# Altium schematic sheet 1.54inch_e-Paper.SchDoc
size A4; Author: Franciszek Zarębski; CompanyName: Politechnika Warszawska; Organization: EITI; Address1: Nowowiejska 15/19; Address2: 00-665 Warszawa; Revision: 1; SheetNumber: 3; SheetTotal: 4; HTTPLink: www.pw.edu.pl; Group_Name: Smartwatch; ProjName: Smartwatch
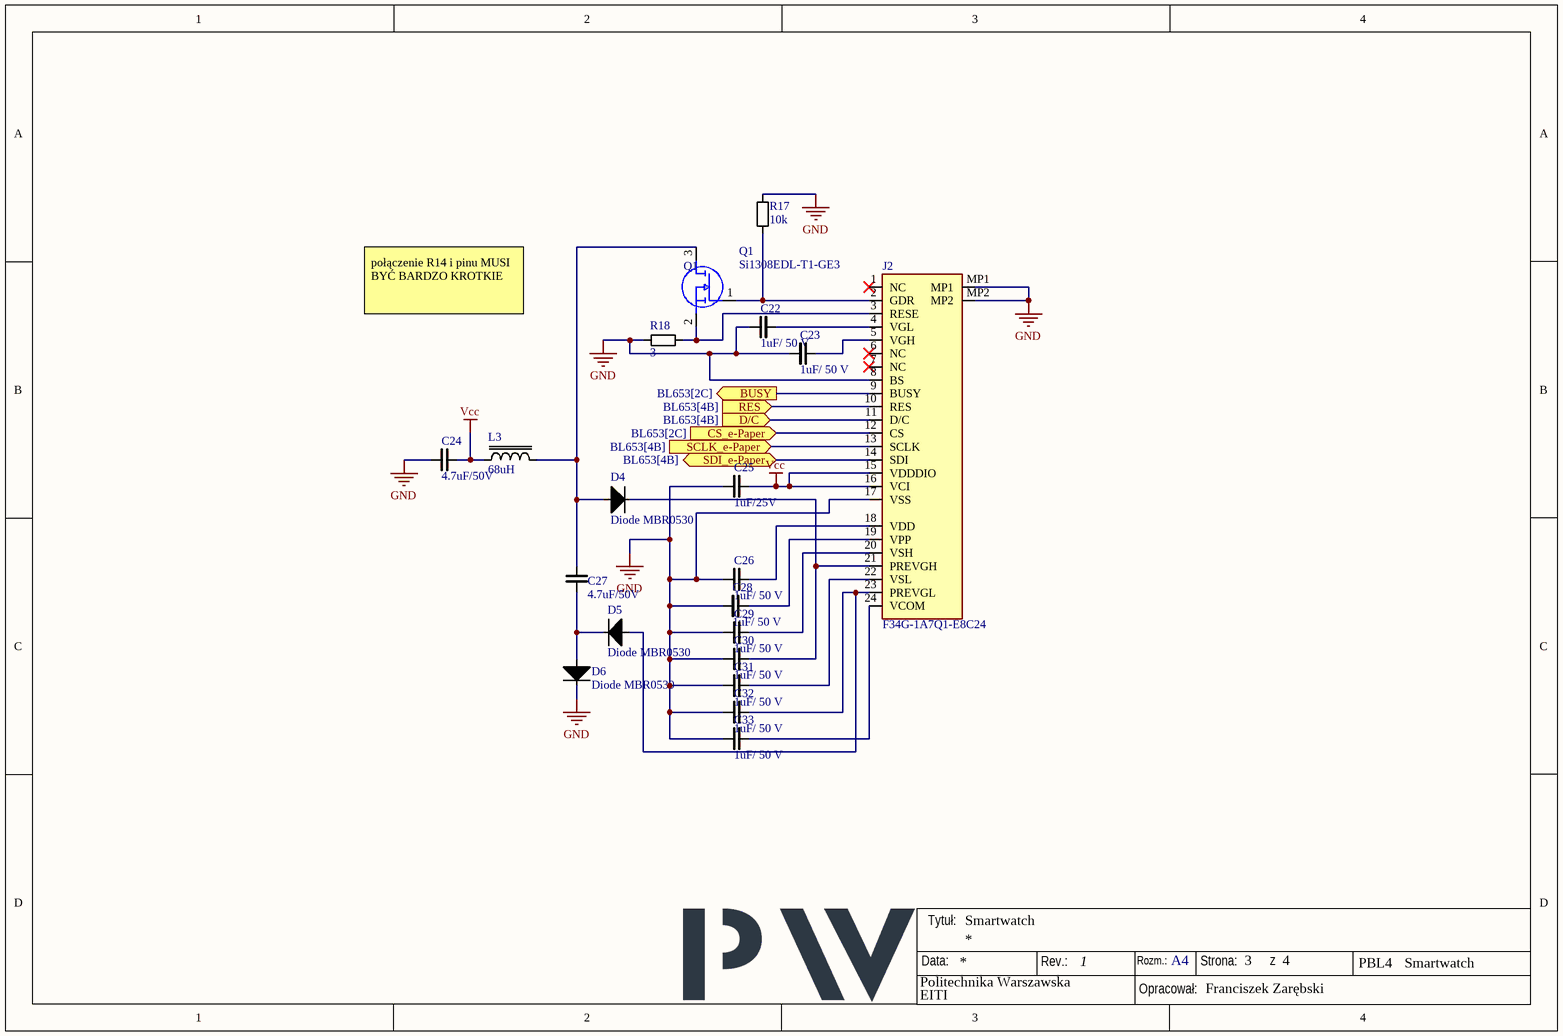
[diagram p0: 1.54inch_e-Paper.SchDoc]

## Parts
C22  1uF/ 50 V  [0402_CAP_REFLOW]
C23  1uF/ 50 V  [0402_CAP_REFLOW]
C24  4.7uF/50V  [0402_CAP_REFLOW]
C25  1uF/25V  [0402_CAP_REFLOW]
C26  1uF/ 50 V  [0402_CAP_REFLOW]
C27  4.7uF/50V  [0402_CAP_REFLOW]
C28  1uF/ 50 V  [0402_CAP_REFLOW]
C29  1uF/ 50 V  [0402_CAP_REFLOW]
C30  1uF/ 50 V  [0402_CAP_REFLOW]
C31  1uF/ 50 V  [0402_CAP_REFLOW]
C32  1uF/ 50 V  [0402_CAP_REFLOW]
C33  1uF/ 50 V  [0402_CAP_REFLOW]
D4  Diode MBR0530  [SOD3716X135N]
D5  Diode MBR0530  [SOD3716X135N]
D6  Diode MBR0530  [SOD3716X135N]
J2  F34G-1A7Q1-E8C24  [F34G1A7Q1E8C24]
L3  68uH  [SRR5828A2R6Y]
Q1  Si1308EDL-T1-GE3  [SOT65P210X110-3N]
R17  10k  [0402_RES_REFLOW]
R18  3  [0402_RES_REFLOW]

## Ports
BUSY (out, see BL653[2C]), CS_e-Paper (in, see BL653[2C]), D/C (in, see BL653[4B]), RES (in, see BL653[4B]), SCLK_e-Paper (in, see BL653[4B]), SDI_e-Paper (bidir, see BL653[4B])

## Nets
GND: C22.1 C23.1 C24.1 C25.1 C26.1 C28.2 C29.1 C30.1 C31.1 C32.1 C33.1 D6.2(K) J2.8(BS) J2.17(VSS) J2.MP1 J2.MP2 R17.2 R18.1
Vcc: C24.2 C25.2 J2.15(VDDDIO) J2.16(VCI) L3.2
BUSY: J2.9(BUSY) ; port BUSY
CS_e-Paper: J2.12(CS) ; port CS_e-Paper
D/C: J2.11(D/C) ; port D/C
RES: J2.10(RES) ; port RES
SCLK_e-Paper: J2.13(SCLK) ; port SCLK_e-Paper
SDI_e-Paper: J2.14(SDI) ; port SDI_e-Paper
NetC22_2: C22.2 J2.4(VGL)
NetC23_2: C23.2 J2.5(VGH)
NetC26_2: C26.2 J2.18(VDD)
NetC27_1: C27.1 D5.2(K) D6.1(A)
NetC27_2: C27.2 D4.1(A) L3.1 Q1.3(D)
NetC28_1: C28.1 J2.19(VPP)
NetC29_2: C29.2 J2.20(VSH)
NetC30_2: C30.2 D4.2(K) J2.21(PREVGH)
NetC31_2: C31.2 J2.22(VSL)
NetC32_2: C32.2 D5.1(A) J2.23(PREVGL)
NetC33_2: C33.2 J2.24(VCOM)
NetJ2_2: J2.2(GDR) Q1.1(G) R17.1
NetJ2_3: J2.3(RESE) Q1.2(S) R18.2

Not connected (* = marked no-connect by the designer): J2 1(NC)* 6(NC)* 7(NC)*

## Notes on the sheet
- połączenie R14 i pinu MUSI BYĆ BARDZO KROTKIE
- Data:
- Tytuł:
- Rev.:
- Rozm.:
- A4
- Strona:
- z
- PBL4
- Opracował:

## Library data of the parts
C22 C23 C26 C28-C33 = Capacitor 1uF/50V: 50 V
C24 C27 = Capacitor 4.7uF/50V: 50V
C25 = Capacitor 1uF/25V: 25V
J2 = FFC & FPC Connectors
L3 = InductorA_A: SRR5828A-680M
Q1 = Si1308EDL-T1-GE3: MOSFET N-Ch 30V 1.5A TrenchFET SC70 Vishay Si1308EDL-T1-GE3 N-channel MOSFET Transistor, 1.5 A, 30 V, 3-Pin SC-70; Geometry.Height: 1.1mm; Mouser Part Number: 78-SI1308EDL-T1-GE3; Mouser Price/Stock: https://www.mouser.co.uk/ProductDetail/Vishay-Semiconductors/SI1308EDL-T1-GE3?qs=bX1%252BNvsK%2FBramh9tgpOaEw%3D%3D; Manufacturer_Name: Vishay; Manufacturer_Part_Number: Si1308EDL-T1-GE3; Datasheet Link: https://componentsearchengine.com/Datasheets/1/SI1308EDL-T1-GE3.pdf
R17 = Resistor R10K
R18 = Resistor R3